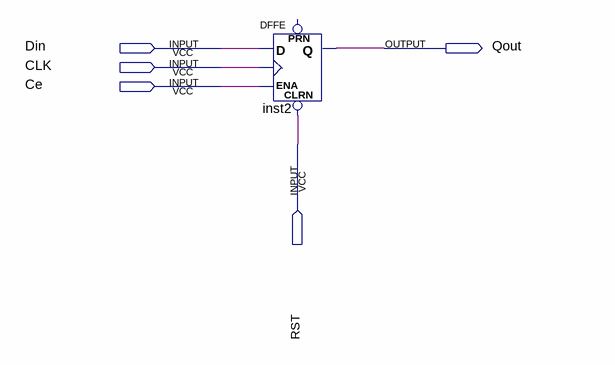
[diagram p0: schematic sheet]
// Quartus schematic week4_ex2.bdf as structural Verilog: 1 symbols, 5 pins
module week4_ex2 (
  input  Din,
  input  CLK,
  input  Ce,
  input  RST,
  output Qout
);

  DFFE inst2 (.CLRN(RST), .D(Din), .CLK(CLK), .ENA(Ce), .Q(Qout));  // open: PRN
endmodule
